# Altium schematic sheet MCUSCH.SchDoc
size A; SheetNumber: 1; SheetTotal: 1; SPICEModelCacheCWLRUCGP: <root> / <DocumentId>CWLRUCGP</DocumentId> / <CacheFrame Number="0"> / <Model Name="cap" Kind="MDL"> / <Text>*Default semiconductor capacitor / .MODEL CAP C()</Text> / </Model> / </CacheFrame> / </root>
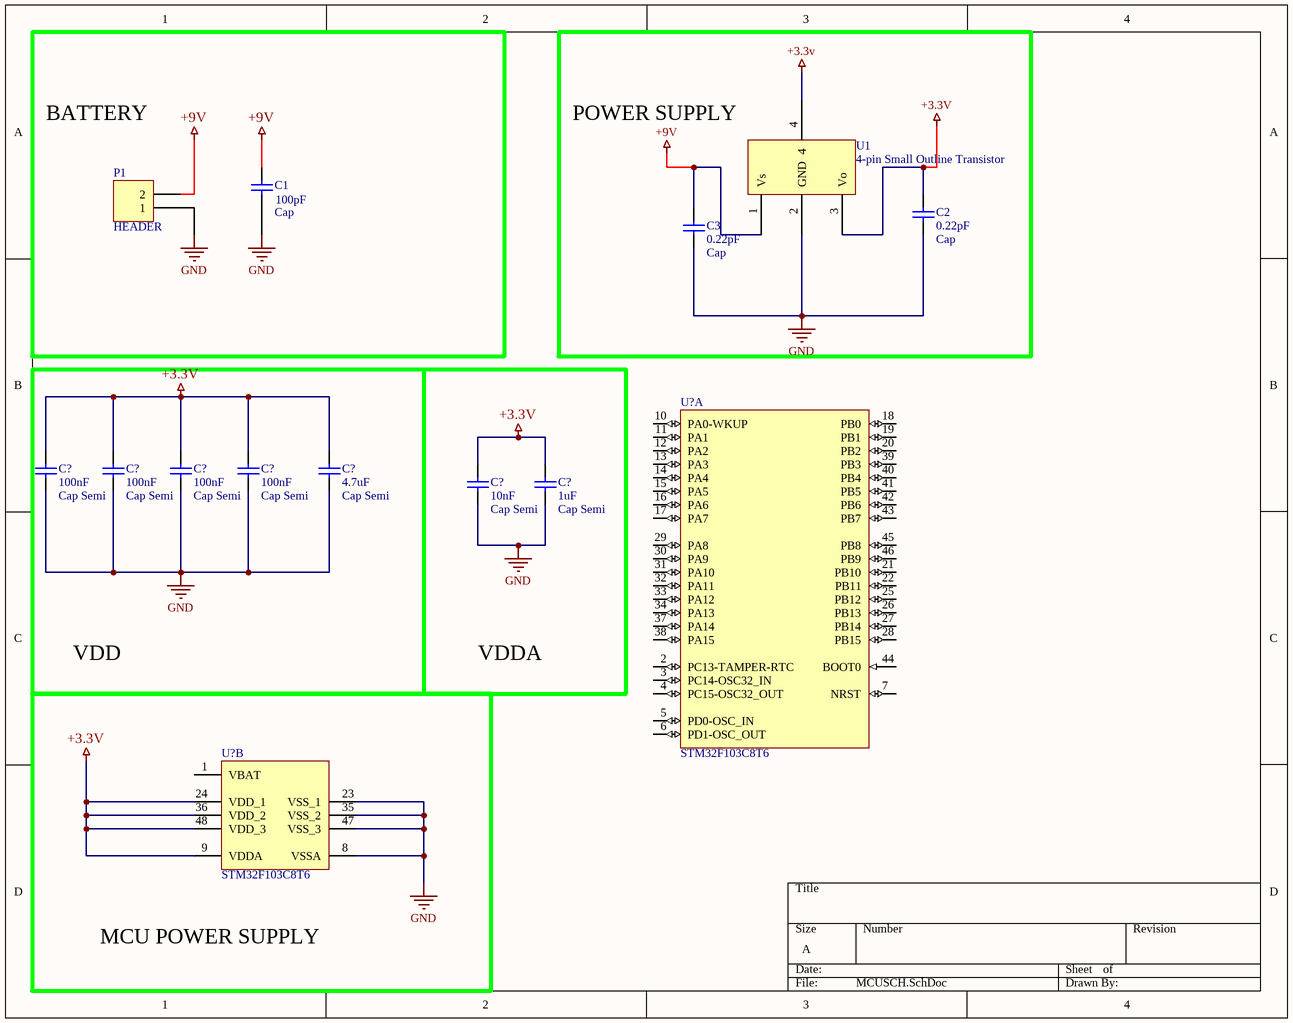
[diagram p0: MCUSCH.SchDoc]

## Parts
(Parts that share a designator on the sheet are numbered #1, #2 ... from top to bottom, then left to right.)
C1  Cap  value 100pF  [RAD-0.3]
C2  Cap  value 0.22pF  [RAD-0.3]
C3  Cap  value 0.22pF  [RAD-0.3]
C?#1  Cap Semi  value 100nF  [1608[0603]]
C?#2  Cap Semi  value 100nF  [1608[0603]]
C?#3  Cap Semi  value 100nF  [1608[0603]]
C?#4  Cap Semi  value 100nF  [1608[0603]]
C?#5  Cap Semi  value 4.7uF  [1608[0603]]
C?#6  Cap Semi  value 10nF  [1608[0603]]
C?#7  Cap Semi  value 1uF  [1608[0603]]
P1  HEADER  [MHDR1X2]
U1  4-pin Small Outline Transistor  [PCBComponent_1]
U?#1  STM32F103C8T6  [STM-LQFP48_N]  (part A of 2)
U?#2  STM32F103C8T6  [STM-LQFP48_N]  (part B of 2)

## Blocks framed on the sheet
BATTERY: C1 P1
POWER SUPPLY: C2 C3 U1
MCU POWER SUPPLY: U?#2

## Nets
+3.3V: C2.2 C?#1.2 C?#2.2 C?#3.2 C?#4.2 C?#5.2 C?#6.2 C?#7.2 U1.3(Vo) U1.4 U?#2.9(VDDA) U?#2.24(VDD_1) U?#2.36(VDD_2) U?#2.48(VDD_3)
+9V: C1.2 C3.2 P1.2 U1.1(Vs)
GND: C1.1 C2.1 C3.1 C?#1.1 C?#2.1 C?#3.1 C?#4.1 C?#5.1 C?#6.1 C?#7.1 P1.1 U1.2(GND) U?#2.8(VSSA) U?#2.23(VSS_1) U?#2.35(VSS_2) U?#2.47(VSS_3)

Not connected (* = marked no-connect by the designer): U?#1 2(PC13-TAMPER-RTC) 3(PC14-OSC32_IN) 4(PC15-OSC32_OUT) 5(PD0-OSC_IN) 6(PD1-OSC_OUT) 7(NRST) 10(PA0-WKUP) 11(PA1) 12(PA2) 13(PA3) 14(PA4) 15(PA5) 16(PA6) 17(PA7) 18(PB0) 19(PB1) 20(PB2) 21(PB10) 22(PB11) 25(PB12) 26(PB13) 27(PB14) 28(PB15) 29(PA8) 30(PA9) 31(PA10) 32(PA11) 33(PA12) 34(PA13) 37(PA14) 38(PA15) 39(PB3) 40(PB4) 41(PB5) 42(PB6) 43(PB7) 44(BOOT0) 45(PB8) 46(PB9); U?#2 1(VBAT)

## Notes on the sheet
- VDD
- VDDA

## Library data of the parts
C1-C3 = Cap: Capacitor; Published: 8-Jun-2000; LatestRevisionDate: 17-Jul-2002; LatestRevisionNote: Re-released for DXP Platform.; PackageReference: RAD-0.3; Publisher: Altium Limited; PackageDescription: Radial Cap, Thru-Hole; 2 Leads; 0.3 in Pin Spacing
C?#1-C?#7 = Cap Semi: Capacitor (Semiconductor SIM Model); Published: 8-Jun-2000; LatestRevisionDate: 29-May-2009; LatestRevisionNote: IPC-7351 Footprint Added.; PackageReference: C1206; Publisher: Altium Limited; PackageDescription: Chip Capacitor
P1 = MHDR1X2: Header, 2-Pin; LatestRevisionDate: 17-Jul-2002; LatestRevisionNote: Re-released for DXP Platform.; Publisher: Altium Limited
U1 = 4 pin regulator: SOT packages encompass a broad variety of semiconductor devices, from RF transistors to diodes and resistor networks. The internal circuitry and pinout (e.g., Collector, Base, Emitter, or Gate, Source, Drain) are entirely dependent on the specific component's part number; OUTPUT VOLTAGE: 5V; ComponentLink1Description: SOT; ComponentLink1URL: https://www.google.com/goto?url=CAESjQEB7keqTX21ZOXNSpJkU3nIPEZw5J1l-B0AOhE7hnM8zeDuRhMH6c0VO7DRYQgU-e_kM-rxIGJRcI8ohvQgYs9vUwDX9_FxT9AIWl4K4bJIas8wyqcdTol44_EUUZOEBLTMta97InY6-2C_v4u3Vpsftajw6wq5LVStmcljtgGhP31RZyHKLZ6lr37DgZs=
U?#1 U?#2 = STM32F103C8T6: ARM Cortex-M3 32-bit MCU, 64 KB Flash, 20 KB Internal RAM, 37 I/Os, 48-pin LQFP, -40 to 85 degC, Tray; A/D Converter: 2x12-bit (10 Channel); FLASH Size (Prog) (kB): 64; I/Os (High Current): 37; Internal RAM Size (kB): 20; Operating Frequency(F) (Processor speed) (MHz): 72; Supply Voltage(Vcc) min (V): 2; DatasheetVersion: Rev. 16; PackageVersion: Rev. 6, 06/2013; PackageReference: LQFP48; PackageDescription: 48-Pin Low Profile Quad Flat Package, 7 x 7 mm Body, 0.5 mm Pitch; Supplier 1: Digi-Key; Supplier Part Number 1: 497-6063-ND; Supplier 2: Farnell; Supplier Part Number 2: 1447637; Supplier 3: Newark; Supplier Part Number 3: 59M2182; Supplier 4: Newark; Supplier Part Number 4: 57P1222; Supplier 5: Mouser; Supplier Part Number 5: 511-STM32F103C8T6; Core: ARM Cortex-M3; Packing: Tray; Mounting Technology: Surface Mount; PartNumber: STM32F103C8T6; ComponentLink1Description: Manufacturer URL; ComponentLink1URL: http://www.st.com/web/en/home.html; ComponentLink2Description: Datasheet; ComponentLink2URL: http://www.st.com/st-web-ui/static/active/en/resource/technical/document/datasheet/CD00161566.pdf; ComponentLink3Description: Package Specification; ComponentLink3URL: http://www.st.com/st-web-ui/static/active/en/resource/technical/document/datasheet/DM00058181.pdf